# Altium project Spindle Drive.PrjPCB
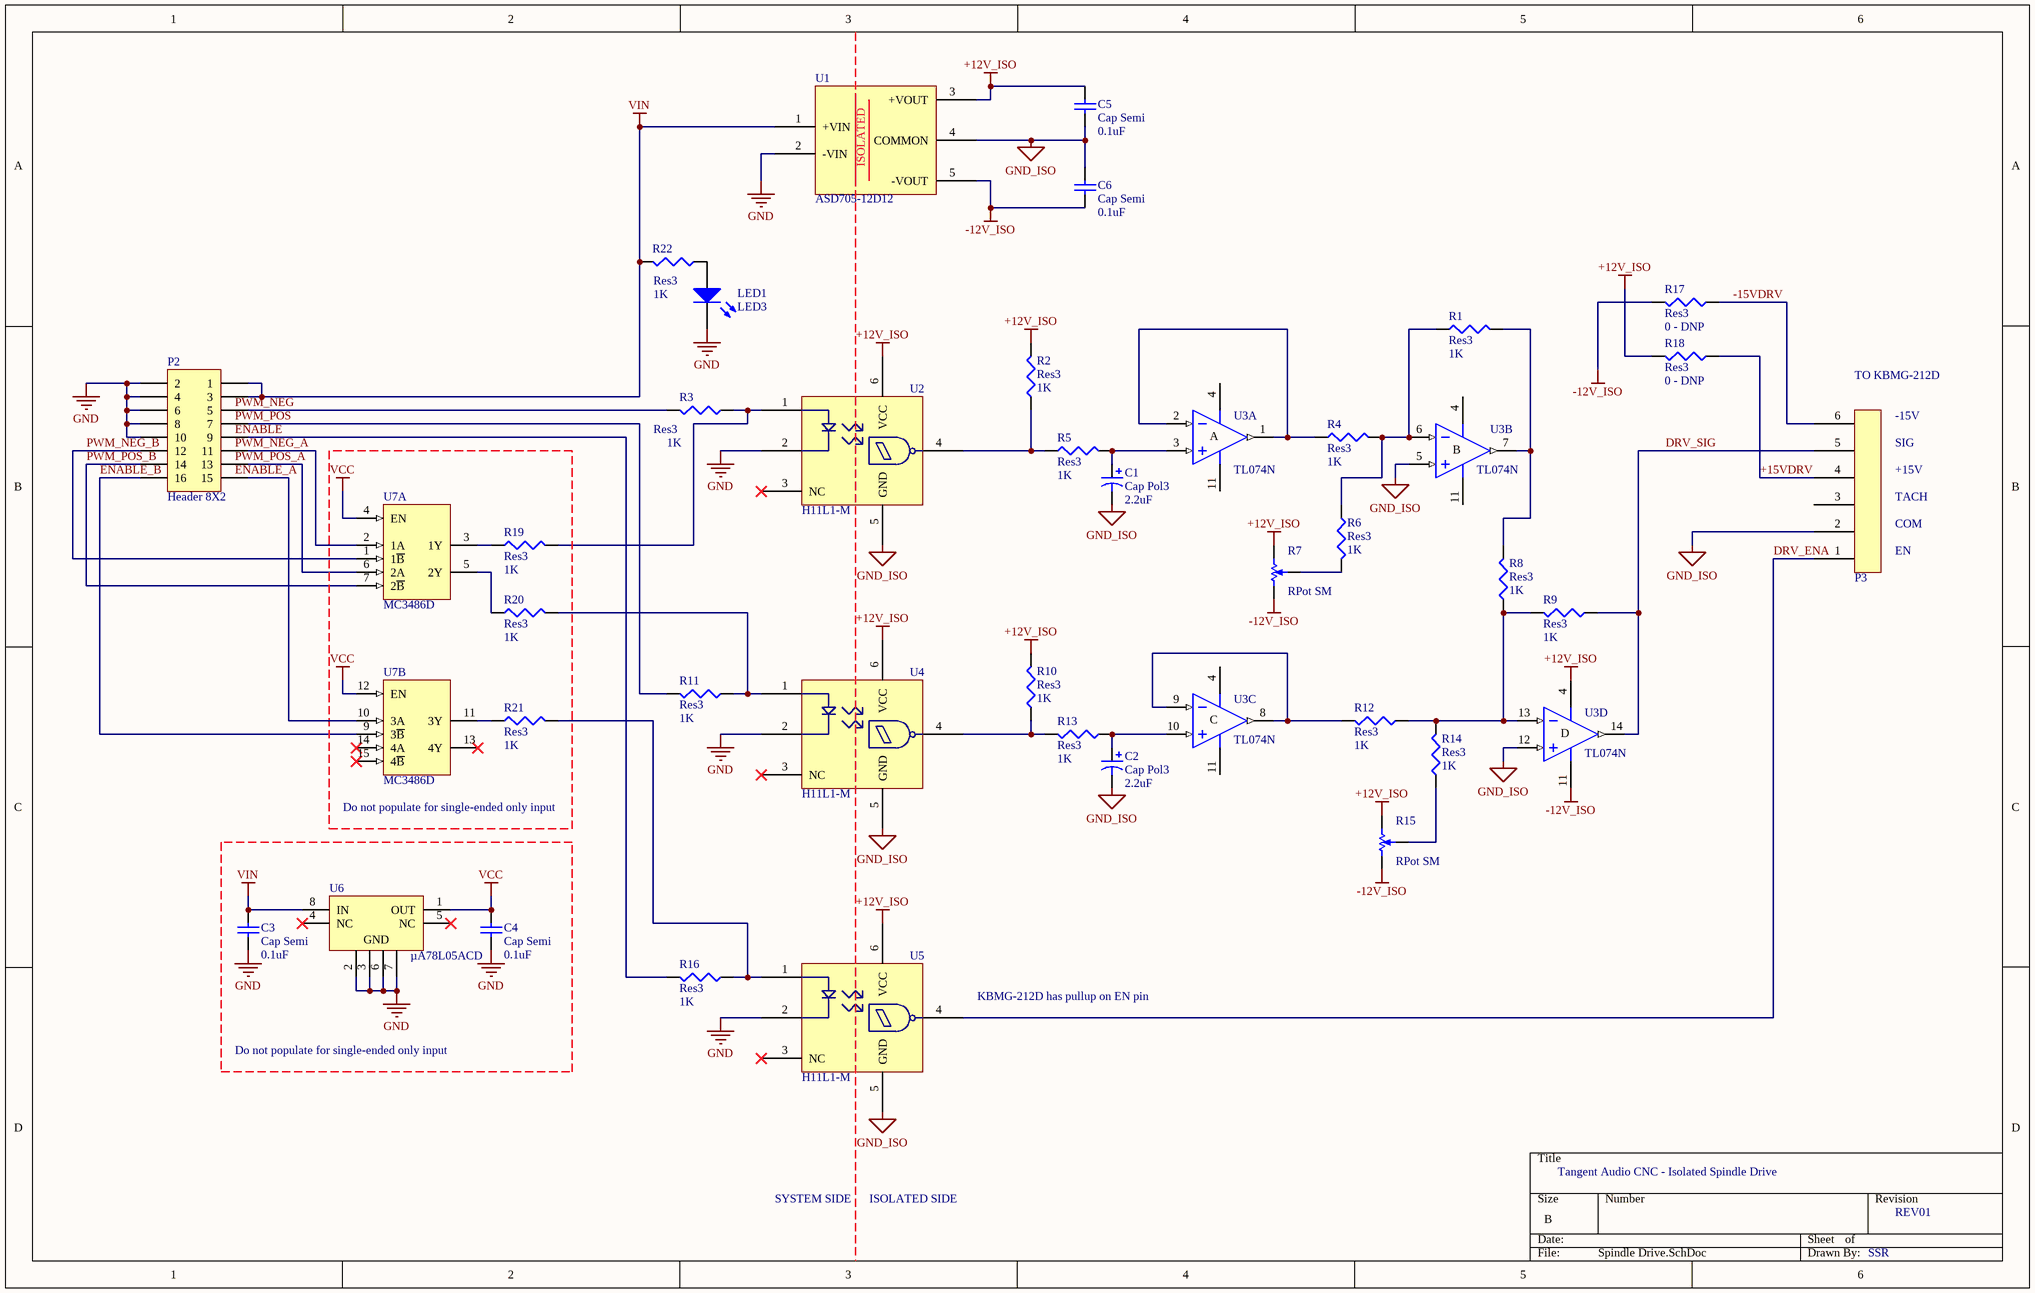
[diagram p0: Spindle Drive.SchDoc]
1 sheet, 38 parts. Net scope: global (net labels, ports and power ports of the same name join across sheets).
Board file: Spindle Drive.PcbDoc

## Sheet Spindle Drive.SchDoc: Tangent Audio CNC - Isolated Spindle Drive
size B; DrawnBy: SSR; Revision: REV01; PageSetup: Record=PageOptions|CenterHorizontal=True|CenterVertical=True|PrintScale=0.69|XCorrection=1.00|YCorrection=1.00|PrintKind=2|BorderSize=5000000|LeftOffset=0|BottomOffset=0|Orientation=2|PaperLength=1000|PaperWidth=1000|Scale=100|PaperSource=7|PrintQuality=-4|MediaType=1|DitherType=10|PaperKind=Letter|PrintScaleMode=1

### Parts
C1  Cap Pol3  value 2.2uF  [Panasonic_HA_B]
C2  Cap Pol3  value 2.2uF  [Panasonic_HA_B]
C3  Cap Semi  value 0.1uF  [1608[0603]]
C4  Cap Semi  value 0.1uF  [1608[0603]]
C5  Cap Semi  value 0.1uF  [1608[0603]]
C6  Cap Semi  value 0.1uF  [1608[0603]]
LED1  LED3  [3.5X2.8X1.9]
P2  Header 8X2  [IDC2.54-V16D]
P3  Phoenix_1933228  [Phoenix_1933228]  (value not drawn)
R1  Res3  value 1K  [J1-0603]
R2  Res3  value 1K  [J1-0603]
R3  Res3  value 1K  [J1-0603]
R4  Res3  value 1K  [J1-0603]
R5  Res3  value 1K  [J1-0603]
R6  Res3  value 1K  [J1-0603]
R7  RPot SM  [Copal_ST-4EA]
R8  Res3  value 1K  [J1-0603]
R9  Res3  value 1K  [J1-0603]
R10  Res3  value 1K  [J1-0603]
R11  Res3  value 1K  [J1-0603]
R12  Res3  value 1K  [J1-0603]
R13  Res3  value 1K  [J1-0603]
R14  Res3  value 1K  [J1-0603]
R15  RPot SM  [Copal_ST-4EA]
R16  Res3  value 1K  [J1-0603]
R17  Res3  value 0 - DNP  [J1-0603]
R18  Res3  value 0 - DNP  [J1-0603]
R19  Res3  value 1K  [J1-0603]
R20  Res3  value 1K  [J1-0603]
R21  Res3  value 1K  [J1-0603]
R22  Res3  value 1K  [J1-0603]
U1  ASD705-12D12  [Astrodyne_ASD705]
U2  H11L1-M  [H11L3M_SMT]
U3  TL074N  [SOIC127P600-14AN]  (parts A,B,C,D of 4)
U4  H11L1-M  [H11L3M_SMT]
U5  H11L1-M  [H11L3M_SMT]
U6  µA78L05ACD  [D008_L]
U7  MC3486D  [D016_N]  (parts A,B of 2)

### Blocks framed on the sheet
Do not populate for single-ended only input: R19-R21 U7
Do not populate for single-ended only input: C3 C4 U6

### Nets
+12V_ISO: C5.1 R2.2 R7.CW(+) R10.2 R15.CW(+) R18.2 U1.3(+VOUT) U2.6(VCC) U3.4(V+) U4.6(VCC) U5.6(VCC)
-12V_ISO: C6.1 R7.CCW(-) R15.CCW(-) R17.2 U1.5(-VOUT) U3.11(V-)
GND: C3.1 C4.1 LED1.2(K) P2.2 P2.4 P2.6 P2.8 P2.10 U1.2(-VIN) U2.2(K) U4.2(K) U5.2(K) U6.2(GND) U6.3(GND) U6.6(GND) U6.7(GND) U7.8(GND)
GND_ISO: C1.2 C2.2 C5.2 C6.2 P3.2 U1.4(COMMON) U2.5(GND) U3.5(IN+) U3.12(IN+) U4.5(GND) U5.5(GND)
VCC: C4.2 U6.1(OUT) U7.4(EN) U7.12(EN) U7.16(VCC)
VIN: C3.2 P2.1 P2.3 R22.2 U1.1(+VIN) U6.8(IN)
+15VDRV: P3.4 R18.1
-15VDRV: P3.6 R17.1
DRV_ENA: P3.1 U5.4(VO)
DRV_SIG: P3.5 R9.1 U3.14(OUT)
ENABLE_B: P2.16 U7.9(3~{B})
PWM_NEG_B: P2.12 U7.1(1~{B})
PWM_POS_B: P2.14 U7.7(2~{B})
NetC1_1: C1.1 R5.2 U3.3(IN+)
NetC2_1: C2.1 R13.1 U3.10(IN+)
NetLED1_1: LED1.1(A) R22.1
NetP2_5: P2.5 R3.2
NetP2_7: P2.7 R11.2
NetP2_9: P2.9 R16.2
NetP2_11: P2.11 U7.2(1A)
NetP2_13: P2.13 U7.6(2A)
NetP2_15: P2.15 U7.10(3A)
NetR1_1: R1.1 R4.2 R6.1 U3.6(IN-)
NetR1_2: R1.2 R8.2 U3.7(OUT)
NetR2_1: R2.1 R5.1 U2.4(VO)
NetR3_1: R3.1 R19.2 U2.1(A)
NetR4_1: R4.1 U3.1(OUT) U3.2(IN-)
NetR6_2: R6.2 R7.W
NetR8_1: R8.1 R9.2 R12.1 R14.2 U3.13(IN-)
NetR10_1: R10.1 R13.2 U4.4(VO)
NetR11_1: R11.1 R20.2 U4.1(A)
NetR12_2: R12.2 U3.8(OUT) U3.9(IN-)
NetR14_1: R14.1 R15.W
NetR16_1: R16.1 R21.2 U5.1(A)
NetR19_1: R19.1 U7.3(1Y)
NetR20_1: R20.1 U7.5(2Y)
NetR21_1: R21.1 U7.11(3Y)

Not connected (* = marked no-connect by the designer): P3 3; U2 3(NC)*; U4 3(NC)*; U5 3(NC)*; U6 4(NC)* 5(NC)*; U7 13(4Y)* 14(4A)* 15(4~{B})*

### Notes on the sheet
- (near P3) TO KBMG-212D
- (near P3) -15V
- (near P3) TACH
- (near P3) +15V
- (near P3) SIG
- (near P3) EN
- (near P3) COM
- KBMG-212D has pullup on EN pin
- SYSTEM SIDE
- ISOLATED SIDE
- Labels drawn without touching a wire or pin: ENABLE, ENABLE_A, PWM_NEG, PWM_NEG_A, PWM_POS, PWM_POS_A
- (in symbol ASD705-12D12) ISOLATED
- (in symbol TL074N, part A) A
- (in symbol TL074N, part B) B
- (in symbol TL074N, part C) C
- (in symbol TL074N, part D) D

### Library data of the parts
C1 C2 = Cap Pol3: Polarized Capacitor (Surface Mount); Published: 8-Jun-2000; LatestRevisionDate: 17-Jul-2002; LatestRevisionNote: Re-released for DXP Platform.; PackageReference: C0805; Publisher: Altium Limited
C3-C6 = Cap Semi: Capacitor (Semiconductor SIM Model); Published: 8-Jun-2000; LatestRevisionDate: 17-Jul-2002; LatestRevisionNote: Re-released for DXP Platform.; PackageReference: C1206; Publisher: Altium Limited
LED1 = LED3: Typical BLUE SiC LED; Published: 8-Jun-2000; LatestRevisionDate: 17-Dec-2003; LatestRevisionNote: PCB Footprint replaced.; DatasheetDocument: 16-Apr-2002; PackageDocument: 16-Apr-2002; PackageReference: 3.5X2.8X1.9; Publisher: Altium Limited
P2 = Header 8X2: Header, 8-Pin, Dual row; LatestRevisionDate: 17-Jul-2002; LatestRevisionNote: Re-released for DXP Platform.; Publisher: Altium Limited
R1-R6 R8-R14 R16-R22 = Res3: Resistor; Published: 8-Jun-2000; LatestRevisionDate: 04-Mar-2005; LatestRevisionNote: PCB Footprint replaced.; PackageReference: J1-0603; Publisher: Altium Limited
R7 R15 = RPot SM: Square Trimming Potentiometer; pin to pad: CCW>1 CW>3 W>2; Published: 17-Dec-2003; DatasheetDocument: Oct-2003; PackageReference: POT4MM-2; Publisher: Altium Limited; ComponentLink1Description: Manufacturer Link; ComponentLink1URL: http://bourns.com/2/search.html
U1 = ASD705-12D12: Astrodyne 9-18VDC in, +/-12VDC out iso regulated DC-DC
U3 = TL074N: Low-Noise JFET-Input Operational Amplifier; Published: 16-Jan-2001; LatestRevisionDate: 04-Mar-2005; LatestRevisionNote: Stylized 3D Model Added.; DatasheetVersion: Aug-1996; PackageVersion: Oct-1995; PackageReference: N014; Publisher: Altium Limited; PackageDescription: DIP; 14 Leads; Row Spacing 7.62 mm; Pitch 2.54 mm; ComponentLink1Description: Manufacturer Link; ComponentLink1URL: http://www.ti.com/; ComponentLink2Description: Datasheet; ComponentLink2URL: http://www-s.ti.com/sc/ds/tl074.pdf
U6 = µA78L05ACD: Positive-Voltage Regulator; Published: 15-Apr-2002; LatestRevisionDate: 13-Apr-2006; LatestRevisionNote: IPC-7351 Footprint Added.; DatasheetVersion: Jul-2000; PackageVersion: Jan-1998; PackageReference: D008; Publisher: Altium Limited; PackageDescription: 8-Pin Small Outline Integrated Circuit 1.27 mm Pitch; Code_IPC: SOIC127P600-8; ComponentLink1Description: Manufacturer Link; ComponentLink1URL: http://www.ti.com/; ComponentLink2Description: Datasheet; ComponentLink2URL: http://www-s.ti.com/sc/ds/ua78l05a.pdf
U7 = MC3486D: Quadruple Line Receiver with 3-State Output; Published: 15-May-2002; LatestRevisionDate: 13-Apr-2006; LatestRevisionNote: IPC-7351 Footprint Added.; DatasheetVersion: Sep-1986; PackageVersion: Jan-1998; PackageReference: D016; Publisher: Altium Limited; PackageDescription: 16-Pin Small Outline Integrated Circuit 1.27 mm Pitch; Code_IPC: SOIC127P600-16; ComponentLink1Description: Manufacturer Link; ComponentLink1URL: http://www.ti.com/; ComponentLink2Description: Datasheet; ComponentLink2URL: http://www-s.ti.com/sc/ds/mc3486.pdf